# Altium schematic sheet STM32 microcontroller Power.SchDoc: STM32 microcontroller Power
size A4; CompanyName: STMicroelectronics; Organization: Microcontrollers Division; DocumentNumber: 5; SheetNumber: 4; SheetTotal: 19
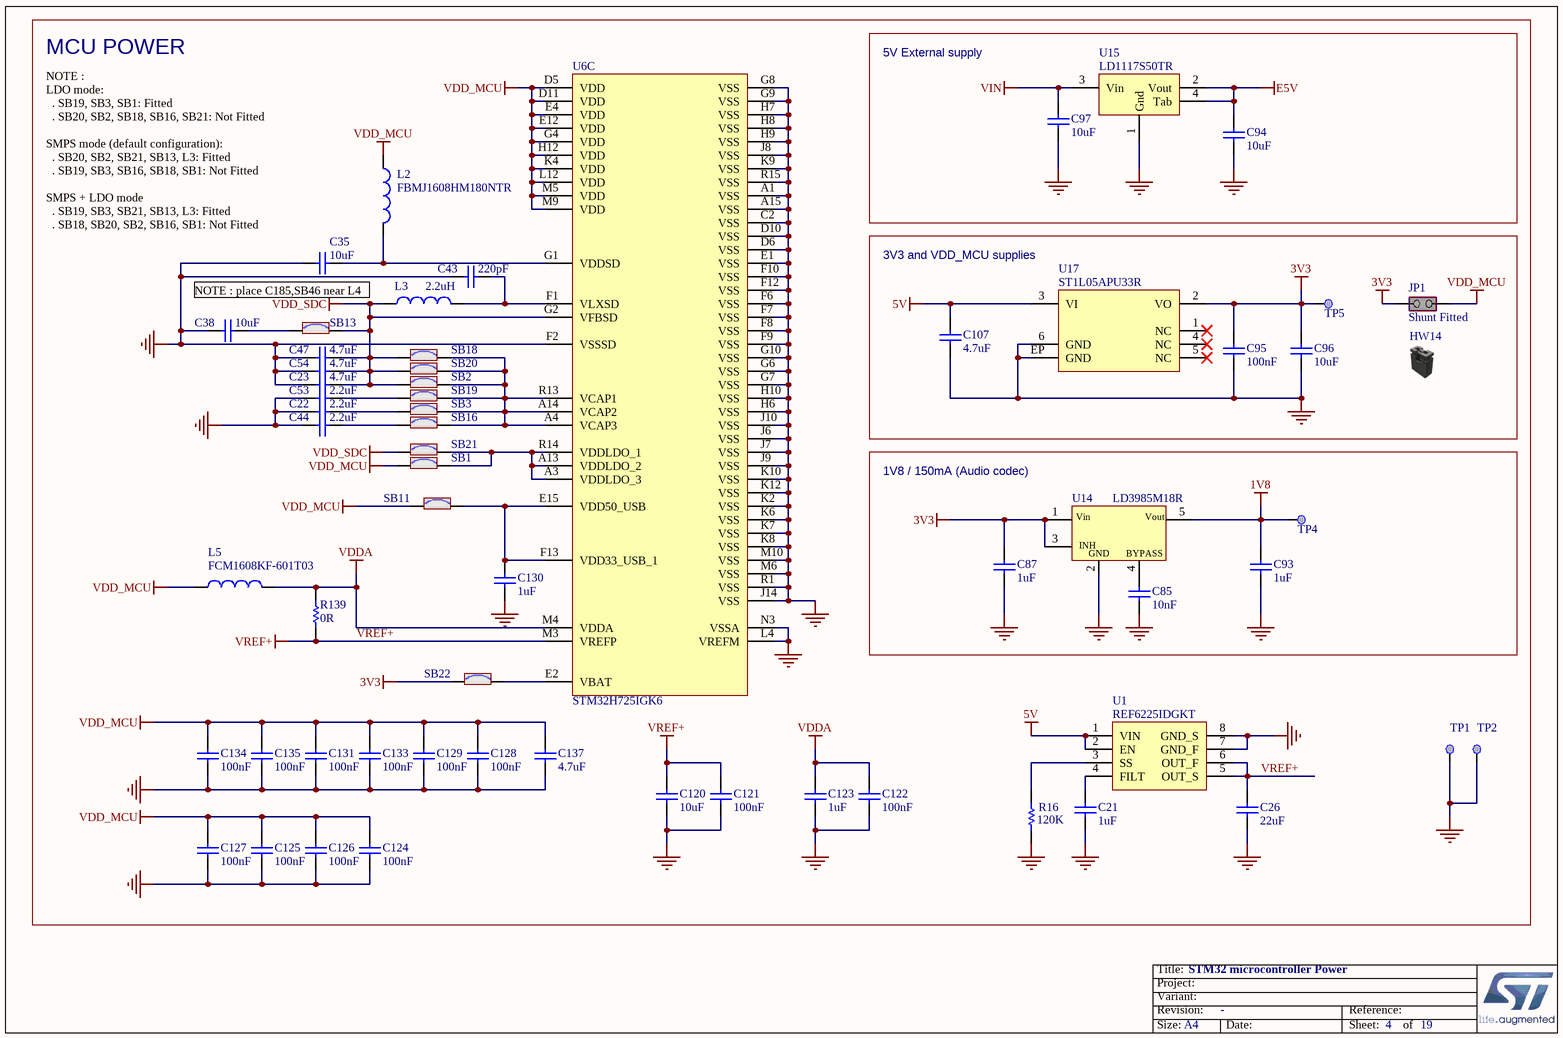
[diagram p0: STM32 microcontroller Power.SchDoc]

## Parts
C21  value 1uF  [C0603]  (hidden comment: Capacitor)
C22  value 2.2uF  [C0603]  (hidden comment: Capacitor)
C23  value 4.7uF  [C0402]  (hidden comment: Capacitor)
C26  value 22uF  [C1210]  (hidden comment: Capacitor)
C35  value 10uF  [C0402]  (hidden comment: Capacitor)
C38  value 10uF  [C0603]  (hidden comment: Capacitor)
C43  value 220pF  [C0402]  (hidden comment: Capacitor)
C44  value 2.2uF  [C0603]  (hidden comment: Capacitor)
C47  value 4.7uF  [C0402]  (hidden comment: Capacitor)
C53  value 2.2uF  [C0603]  (hidden comment: Capacitor)
C54  value 4.7uF  [C0402]  (hidden comment: Capacitor)
C85  value 10nF  [C0402]  (hidden comment: Capacitor)
C87  value 1uF  [C0402]  (hidden comment: Capacitor)
C93  value 1uF  [C0402]  (hidden comment: Capacitor)
C94  value 10uF  [C0805]  (hidden comment: Capacitor)
C95  value 100nF  [C0402]  (hidden comment: Capacitor)
C96  value 10uF  [C0805]  (hidden comment: Capacitor)
C97  value 10uF  [C0805]  (hidden comment: Capacitor)
C107  value 4.7uF  [C0603]  (hidden comment: Capacitor)
C120  value 10uF  [C0805]  (hidden comment: Capacitor)
C121  value 100nF  [C0402]  (hidden comment: Capacitor)
C122  value 100nF  [C0402]  (hidden comment: Capacitor)
C123  value 1uF  [C0402]  (hidden comment: Capacitor)
C124  value 100nF  [C0402]  (hidden comment: Capacitor)
C125  value 100nF  [C0402]  (hidden comment: Capacitor)
C126  value 100nF  [C0402]  (hidden comment: Capacitor)
C127  value 100nF  [C0402]  (hidden comment: Capacitor)
C128  value 100nF  [C0402]  (hidden comment: Capacitor)
C129  value 100nF  [C0402]  (hidden comment: Capacitor)
C130  value 1uF  [C0603]  (hidden comment: Capacitor)
C131  value 100nF  [C0402]  (hidden comment: Capacitor)
C133  value 100nF  [C0402]  (hidden comment: Capacitor)
C134  value 100nF  [C0402]  (hidden comment: Capacitor)
C135  value 100nF  [C0402]  (hidden comment: Capacitor)
C137  value 4.7uF  [C0402]  (hidden comment: Capacitor)
HW14  Shunt Black 2.54mm  (value not drawn)  (mechanical)
JP1  value Shunt Fitted  [CON_SAMTEC_TSW-102-07-G-S]  (hidden comment: Jumper_Header 2x1 Fitted)
L2  value FBMJ1608HM180NTR  [IND_TAIYO-YUDEN_FBMJ1608]  (hidden comment: Inductor)
L3  value 2.2uH  [IND_2016_MURATA_LQM2MPN2R2NG0]  (hidden comment: Inductor)
L5  Manufacturer_Part_Number: FCM1608KF-601T03  [L0603]  (hidden comment: BEAD)
R16  value 120K  [R0402]  (hidden comment: Resistor)
R139  value 0R  [R0603]  (hidden comment: Resistor)
SB1  SB_ON  [SOLDER-BRIDGE_R0603-0R]  (value not drawn)
SB2  SB_ON  [SOLDER-BRIDGE_R0603-0R]  (value not drawn)
SB3  SB_ON  [SOLDER-BRIDGE_R0603-0R]  (value not drawn)
SB11  SB_ON  [SOLDER-BRIDGE_R0603-0R]  (value not drawn)
SB13  SB_ON  [SOLDER-BRIDGE_R0603-0R]  (value not drawn)
SB16  SB_ON  [SOLDER-BRIDGE_R0603-0R]  (value not drawn)
SB18  SB_ON  [SOLDER-BRIDGE_R0603-0R]  (value not drawn)
SB19  SB_ON  [SOLDER-BRIDGE_R0603-0R]  (value not drawn)
SB20  SB_ON  [SOLDER-BRIDGE_R0603-0R]  (value not drawn)
SB21  SB_ON  [SOLDER-BRIDGE_R0603-0R]  (value not drawn)
SB22  SB_ON  [SOLDER-BRIDGE_R0603-0R]  (value not drawn)
TP1  Test Point  [TP_SMD_0-3MM]  (value not drawn)  (no BOM)
TP2  Test Point  [TP_SMD_0-3MM]  (value not drawn)  (no BOM)
TP4  Test Point  [TP_SMD_0-3MM]  (value not drawn)  (no BOM)
TP5  Test Point  [TP_SMD_0-3MM]  (value not drawn)  (no BOM)
U1  REF6225IDGKT  [ICC_VSSOP8_DGK_S-PDSO-G8_3X3_P065]
U6  value STM32H725IGK6  [ICC_UFBGA201_176+25_10X10_P065]  (hidden comment: STM32H725IGK6U)  (part C of 3)
U14  LD3985M18R  [REG_SOT23-5L]
U15  LD1117S50TR  [REG_SOT223-TAB]
U17  ST1L05APU33R  [ICC_DFN6-EPAD_3X3_P095]

## Blocks framed on the sheet
5V External supply: C94 C97 U15
3V3 and VDD_MCU supplies: C95 C96 C107 HW14 JP1 TP5 U17
1V8 / 150mA (Audio codec): C85 C87 C93 TP4 U14

## Nets
1V8: C93.2 TP4.1 U14.5(Vout)
3V3: C87.2 C95.1 C96.2 JP1.2(NO) SB22.1 TP5.1 U14.1(Vin) U14.3(CE) U17.2(VO)
5V: C107.2 U1.1(VIN) U1.2(EN) U17.3(VI)
E5V: C94.2 U15.2(Vout) U15.4(Tab)
GND: C21.1 C22.1 C23.2 C26.1 C35.1 C38.1 C43.1 C44.1 C47.2 C53.1 C54.2 C85.1 C87.1 C93.1 C94.1 C95.2 C96.1 C97.1 C107.1 C120.1 C121.1 C122.1 C123.2 C124.1 C125.1 C126.1 C127.1 C128.1 C129.1 C130.2 C131.1 C133.1 C134.1 C135.1 C137.1 R16.1 TP1.1 TP2.1 U1.7(GND_F) U1.8(GND_S) U6.A1(VSS) U6.A15(VSS) U6.C2(VSS) U6.D6(VSS) U6.D10(VSS) U6.E1(VSS) U6.F2(VSSSD) U6.F6(VSS) U6.F7(VSS) U6.F8(VSS) U6.F9(VSS) U6.F10(VSS) U6.F12(VSS) U6.G6(VSS) U6.G7(VSS) U6.G8(VSS) U6.G9(VSS) U6.G10(VSS) U6.H6(VSS) U6.H7(VSS) U6.H8(VSS) U6.H9(VSS) U6.H10(VSS) U6.J6(VSS) U6.J7(VSS) U6.J8(VSS) U6.J9(VSS) U6.J10(VSS) U6.J14(VSS) U6.K2(VSS) U6.K6(VSS) U6.K7(VSS) U6.K8(VSS) U6.K9(VSS) U6.K10(VSS) U6.K12(VSS) U6.L4(VREFM) U6.M6(VSS) U6.M10(VSS) U6.N3(VSSA) U6.R1(VSS) U6.R15(VSS) U14.2(GND) U15.1(Gnd) U17.6(GND) U17.EP(GND)
VDD_MCU: C124.2 C125.2 C126.2 C127.2 C128.2 C129.2 C131.2 C133.2 C134.2 C135.2 C137.2 JP1.1(COMMON) L2.1 L5.1 SB1.1 SB11.1 U6.D5(VDD) U6.D11(VDD) U6.E4(VDD) U6.E12(VDD) U6.G4(VDD) U6.H12(VDD) U6.K4(VDD) U6.L12(VDD) U6.M5(VDD) U6.M9(VDD)
VDD_SDC: C23.1 C47.1 C54.1 L3.1 SB2.1 SB13.2 SB18.1 SB20.1 SB21.1 U6.G2(VFBSD)
VDDA: C122.2 C123.1 L5.2 R139.2 U6.M4(VDDA)
VIN: C97.2 U15.3(Vin)
VREF+: C26.2 C120.2 C121.2 R139.1 U1.5(OUT_S) U1.6(OUT_F) U6.M3(VREFP)
NetC21_2: C21.2 U1.4(FILT)
NetC22_2: C22.2 SB3.1
NetC35_2: C35.2 L2.2 U6.G1(VDDSD)
NetC38_2: C38.2 SB13.1
NetC43_2: C43.2 L3.2 U6.F1(VLXSD)
NetC44_2: C44.2 SB16.1
NetC53_2: C53.2 SB19.1
NetC85_2: C85.2 U14.4(BYPASS)
NetC130_1: C130.1 SB11.2 U6.E15(VDD50_USB) U6.F13(VDD33_USB_1)
NetR16_2: R16.2 U1.3(SS)
NetSB1_2: SB1.2 SB21.2 U6.A3(VDDLDO_3) U6.A13(VDDLDO_2) U6.R14(VDDLDO_1)
NetSB2_2: SB2.2 SB3.2 SB16.2 SB18.2 SB19.2 SB20.2 U6.A4(VCAP3) U6.A14(VCAP2) U6.R13(VCAP1)
NetSB22_2: SB22.2 U6.E2(VBAT)

Not connected (* = marked no-connect by the designer): U17 1(NC)* 4(NC)* 5(NC)*

## Notes on the sheet
- MCU POWER
- (near C35) NOTE :
  LDO mode:
  . SB19, SB3, SB1: Fitted
  . SB20, SB2, SB18, SB16, SB21: Not Fitted
  SMPS mode (default configuration):
  . SB20, SB2, SB21, SB13, L3: Fitted
  . SB19, SB3, SB16, SB18, SB1: Not Fitted
  SMPS + LDO mode
  . SB19, SB3, SB21, SB13, L3: Fitted
  . SB18, SB20, SB2, SB16, SB1: Not Fitted
- NOTE : place C185,SB46 near L4
- Title:
- Project:
- Size:
- Revision:
- Variant:
- A4
- -
- Date:
- Reference:
- Sheet:
- of
- (in symbol MCD-00078) INH

## Library data of the parts
C21 C130 = MCD-00010: Capacitor, MLCC, 1uF, 16V, X5R, 10%, 0603, T=0,8mm; Manufacturer_Part_Number: CC0603KRX5R7BB105; Manufacturer: YAGEO; Provided_By: SUBCO; Internal_Part_Number: MCD-00010; Status: Released; Part_Type: Capacitor; Package: C0603; ComponentLink1Description: Datasheet; ComponentLink1URL: http://tunmcdsvn.tun.st.com/Component_Datasheet_Library/Trunk/Capacitors/Yageo_Multilayer_capacitor_X5R_series_100pF_to_100uF
C22 C44 C53 = MCD-00012: Capacitor, MLCC, 2.2uF, 10V, X5R, 10%, 0603, T=0,8mm; Manufacturer_Part_Number: CC0603KRX5R6BB225; Manufacturer: YAGEO; Alternate_Manufacturer_Part_Number: C0603C225K8PACTU; Alternate_Manufacturer: KEMET; Provided_By: SUBCO; Internal_Part_Number: MCD-00012; Status: Released; Part_Type: Capacitor; Package: C0603; ComponentLink1Description: Datasheet; ComponentLink1URL: http://tunmcdsvn.tun.st.com/Component_Datasheet_Library/Trunk/Capacitors/Yageo_Multilayer_capacitor_X5R_series_100pF_to_100uF
C23 C47 C54 = MCD-01356: Capacitor, MLCC, 4.7uF, 6V3, X5R, 20%, 0402, T=0,5mm; Manufacturer_Part_Number: GRM155R60J475ME47; Manufacturer: MURATA; Provided_By: SUBCO; Internal_Part_Number: MCD-01356; ComponentLink1Description: Datasheet; Status: Released; Part_Type: Capacitor; Package: C0402; ComponentLink1URL: http://tunmcdsvn.tun.st.com/Component_Datasheet_Library/Trunk/Capacitors/Murata_Capacitor_GR_series
C26 = MCD-00614: Capacitor, MLCC, 22uF, 16V, 1210, X7R, 20%, T=2,5mm, ESR 2mohm@410KHz; Manufacturer_Part_Number: GCM32ER71C226ME19; Manufacturer: MURATA; Provided_By: SUBCO; Internal_Part_Number: MCD-00614; Status: Checked; Part_Type: Capacitor; Package: C1210; ComponentLink1Description: Datasheet; ComponentLink1URL: http://tunmcdsvn.tun.st.com/Component_Datasheet_Library/Trunk/Capacitors/Murata_Capacitor_GC_series
C35 = MCD-01355: Capacitor, MLCC, 10uF, 4V, X5R, 20%, 0402, T=0,5mm; Manufacturer_Part_Number: GRM155R60G106ME44; Manufacturer: MURATA; Provided_By: SUBCO; Internal_Part_Number: MCD-01355; ComponentLink1Description: Datasheet; Status: Released; Part_Type: Capacitor; Package: C0402; ComponentLink1URL: http://tunmcdsvn.tun.st.com/Component_Datasheet_Library/Trunk/Capacitors/Murata_Capacitor_GR_series
C38 = MCD-01341: Capacitor, MLCC, 10uF, 6V3, X5R, 20%, 0603, T=0,8mm; Manufacturer_Part_Number: GRM188R60J106ME47D; Manufacturer: MURATA; Provided_By: SUBCO; Internal_Part_Number: MCD-01341; ComponentLink1Description: Datasheet; Status: Released; Part_Type: Capacitor; Package: C0603; ComponentLink1URL: http://tunmcdsvn.tun.st.com/Component_Datasheet_Library/Trunk/Capacitors/Murata_Capacitor_GR_series
C43 = MCD-01225: Capacitor, MLCC, 220pF, 50V, NPO, 5%, 0402, T=0,5mm; Manufacturer_Part_Number: CC0402JRNPO9BN221; Manufacturer: YAGEO; Provided_By: SUBCO; Internal_Part_Number: MCD-01225; Status: Released; Part_Type: Capacitor; Package: C0402; ComponentLink1Description: Datasheet; ComponentLink1URL: http://tunmcdsvn.tun.st.com/Component_Datasheet_Library/Trunk/Capacitors/Yageo_Capacitor_NP0_16V-to-50V
C85 = MCD-00011: Capacitor, MLCC, 10nF, 16V, X7R, 10%, 0402, T=0.5mm; Manufacturer_Part_Number: CC0402KRX7R7BB103; Manufacturer: YAGEO; ECCN_US: EAR99; ECCN_EU: NEC; Provided_By: SUBCO; Internal_Part_Number: MCD-00011; Status: Released; Part_Type: Capacitor; Package: C0402; ComponentLink1Description: Datasheet; ComponentLink1URL: http://tunmcdsvn.tun.st.com/Component_Datasheet_Library/Trunk/Capacitors/Yageo_Multilayer_Capacitor_X7R_series_100pF_to_22uF
C87 C93 = MCD-00095: Capacitor, MLCC, 1uF, 6V3, X5R, 10%, 0402, T=0,5mm; Manufacturer_Part_Number: GRM155R61E105KA12; Manufacturer: MURATA; Alternate_Manufacturer_Part_Number: GRM155R60J105KE19; ECCN_US: EAR99; ECCN_EU: NEC; Provided_By: SUBCO; Internal_Part_Number: MCD-00095; Status: Released; Part_Type: Capacitor; Alternate_Manufacturer: MURATA; Package: C0402; ComponentLink1Description: Datasheet; ComponentLink1URL: http://tunmcdsvn.tun.st.com/Component_Datasheet_Library/Trunk/Capacitors/Murata_Capacitor_GR_series
C94 C96 C97 C120 = MCD-00014: Capacitor, MLCC, 10uF, 25V, X5R, 10%, 0805, T=0,85mm; Manufacturer_Part_Number: CC0805KRX5R8BB106; Manufacturer: YAGEO; Provided_By: SUBCO; Internal_Part_Number: MCD-00014; ComponentLink1Description: Datasheet; Status: Released; Part_Type: Capacitor; Package: C0805; ComponentLink1URL: http://tunmcdsvn.tun.st.com/Component_Datasheet_Library/Trunk/Capacitors/Yageo_Multilayer_capacitor_X5R_series_100pF_to_100uF
C95 C121 C122 C124-C129 C131 C133-C135 = MCD-00102: Capacitor, MLCC, 100nF, 16V, X7R, 10%, 0402, T=0,5mm; Manufacturer_Part_Number: CC0402KRX7R7BB104; Manufacturer: YAGEO; Alternate_Manufacturer_Part_Number: GCM155R71C104KA55D; Alternate_Manufacturer: MURATA; Provided_By: SUBCO; Internal_Part_Number: MCD-00102; Status: Released; Part_Type: Capacitor; Package: C0402; ComponentLink1Description: Datasheet; ComponentLink1URL: http://tunmcdsvn.tun.st.com/Component_Datasheet_Library/Trunk/Capacitors/Yageo_Multilayer_Capacitor_X7R_series_100pF_to_22uF
C107 = MCD-00097: Capacitor, MLCC, 4.7uF, 16V, X5R, 20%, 0603, T=0,8mm; Manufacturer_Part_Number: GRM188R61C475KE11; Manufacturer: MURATA; Alternate_Manufacturer_Part_Number: GRM188R61C475MAAJ; ECCN_US: EAR99; ECCN_EU: NEC; Provided_By: SUBCO; Internal_Part_Number: MCD-00097; Status: Released; Part_Type: Capacitor; Alternate_Manufacturer: Murata; Package: C0603; ComponentLink1Description: Datasheet; ComponentLink1URL: http://tunmcdsvn.tun.st.com/Component_Datasheet_Library/Trunk/Capacitors/Murata_Capacitor_GR_series
C123 = MCD-01722: Capacitor, 1uF, 10V, X5R, 10%, 0402, T=0.5mm; Manufacturer_Part_Number: CC0402KRX5R6BB105; Manufacturer: YAGEO; Provided_By: SUBCO; Internal_Part_Number: MCD-01722; Status: Released; Part_Type: Capacitor; Package: C0402; ComponentLink1Description: Datasheet; ComponentLink1URL: http://tunmcdsvn.tun.st.com/Component_Datasheet_Library/Trunk/Capacitors/Yageo_Multilayer_capacitor_X5R_series_100pF_to_100uF/Yageo_Multilayer_capacitor_X5R_100pF_to_100uF.pdf; ECCN_US: N/A; ECCN_EU: N/A
C137 = MCD-01356: Capacitor, MLCC, 4.7uF, 6V3, X5R, 20%, 0402, T=0,5mm; Manufacturer_Part_Number: GRM155R60J475ME47; Manufacturer: MURATA; ECCN_US: EAR99; ECCN_EU: NEC; Provided_By: SUBCO; Internal_Part_Number: MCD-01356; Status: Released; Part_Type: Capacitor; Package: C0402; ComponentLink1Description: Datasheet; ComponentLink1URL: http://tunmcdsvn.tun.st.com/Component_Datasheet_Library/Trunk/Capacitors/Murata_Capacitor_GR_series
HW14 = MCD-00043: SHUNT 2.54mm BLACK; Manufacturer_Part_Number: SNT-100-BK-G; Manufacturer: SAMTEC; Part_Type: Mechanical; Alternate_Manufacturer_Part_Number: 316102S111A; Alternate_Manufacturer: JIUBABA; Provided_By: SUBCO; Value: SNT-100-BK-G; Internal_Part_Number: MCD-00043; ComponentLink1Description: Datasheet; Status: Released; ComponentLink1URL: http://tunmcdsvn.tun.st.com/Component_Datasheet_Library/Trunk/Connectors/Samtec_Shunt_Jumper_SNT100
JP1 = MCD-00683: Header, 2x1, 2,54mm, VR, TH, Height 5.84mm/2.54mm - Shunt Fitted by default; Part_Type: Connector; Manufacturer_Part_Number: TSW-102-07-x-S; Manufacturer: SAMTEC; Provided_By: SUBCO; Internal_Part_Number: MCD-00683; Status: Released; ComponentLink1Description: Datasheet; ComponentLink1URL: http://tunmcdsvn.tun.st.com/Component_Datasheet_Library/Trunk/Connectors/Samtec_TSW-HTSW-series
L2 = MCD-01431: Ferrite Bead 18 ohm@100MHz 0603; Manufacturer: TAIYO YUDEN; Provided_By: SUBCO; Internal_Part_Number: MCD-01431; Status: Checked; Part_Type: Inductor; Manufacturer_Part_Number: FBMJ1608HM180NTR; Package: L0603; ComponentLink1Description: Datasheet; ComponentLink1URL: http://tunmcdsvn.tun.st.com/Component_Datasheet_Library/Trunk/Inductors/TaiyoYuden_Bead_FBA,%20FBR%20Series/TaiyoYuden_Bead_FBA,%20FBR%20Series.pdf
L3 = MCD-01110: Inductor 2.2uH, 2x1.6x0.9mm; Manufacturer_Part_Number: LQM2MPN2R2NG0; Manufacturer: MURATA; Provided_By: SUBCO; Internal_Part_Number: MCD-01110; Status: Footprint available; Part_Type: Inductor; ComponentLink1Description: Datasheet; ComponentLink1URL: http://tunmcdsvn.tun.st.com/Component_Datasheet_Library/Trunk/Inductors/Murata_inductor_LQM2MPN/Murata_inductor_LQM2MPN.pdf; ECCN_US: n/a; ECCN_EU: n/a
L5 = MCD-00047: SMD Chip ferrite bead, 600R@100MHz +/-25%, 350mA, 500mohm DC, 0603, T=0.8mm; Part_Type: Inductor; Manufacturer: TAI-TECH; Provided_By: SUBCO; Internal_Part_Number: MCD-00047; Value: 600R@100MHz; Status: Released; ComponentLink1Description: Datasheet; ComponentLink1URL: http://tunmcdsvn.tun.st.com/Component_Datasheet_Library/Trunk/Inductors/TaiTech_Bead_FCM1608_series
R16 = MCD-00166: Resistor,120K,0402,1%,1/16W; Manufacturer_Part_Number: RC0402FR-07120KL; Manufacturer: YAGEO; Provided_By: SUBCO; Internal_Part_Number: MCD-00166; Status: Footprint available; Part_Type: Resistor; Package: R0402; ComponentLink1Description: Datasheet; ComponentLink1URL: http://tunmcdsvn.tun.st.com/Component_Datasheet_Library/Trunk/Resistors/Yageo_Resistor_RC0402-series
R139 = MCD-00056: Resistor,0R,0603,5%,1/10W; Manufacturer_Part_Number: RC0603JR-070RL; Manufacturer: YAGEO; ECCN_US: EAR99; ECCN_EU: NEC; Provided_By: SUBCO; Internal_Part_Number: MCD-00056; Status: Released; Part_Type: Resistor; Package: R0603; ComponentLink1Description: Datasheet; ComponentLink1URL: http://tunmcdsvn.tun.st.com/Component_Datasheet_Library/Trunk/Resistors/Yageo_Resistor_RC0603-series
SB1-SB3 SB11 SB13 SB16 SB18-SB22 = MCD-00071: Solder Bridge ON; Part_Type: Mechanical; Manufacturer_Part_Number: RC0603JR-070RL; Manufacturer: YAGEO; Provided_By: SUBCO; Internal_Part_Number: MCD-00071; Status: Released; Package: SB0603; ComponentLink1Description: Datasheet; ComponentLink1URL: http://tunmcdsvn.tun.st.com/Component_Datasheet_Library/Trunk/Resistors/Yageo_Resistor_RC0603-series
TP1 TP2 TP4 TP5 = MCD-00630: Test Point 0.3mm; Part_Type: Mechanical; Internal_Part_Number: MCD-00630; Status: Released; Provided_By: n/a; ComponentLink1Description: Datasheet
U1 = MCD-01138: IC VREF SERIES 2.5V 8VSSOP; Manufacturer: TI; Provided_By: SUBCO; Internal_Part_Number: MCD-01138; Value: REF6225IDGKT; Status: Footprint available; Part_Type: IC; Manufacturer_Part_Number: REF6225IDGKT; Package: VSSOP8; ComponentLink1Description: Datasheet; ComponentLink1URL: http://tunmcdsvn.tun.st.com/Component_Datasheet_Library/Trunk/IC/TI_REF_REF6225IDGKT/TI_REF_REF6225IDGKT.pdf
U6 = MCD-01673: STM32H725IGK6 MCU, Cut1.0, 10x10x0.6mm, Pitch0.65mm, Int SMPS; Part_Type: IC; Manufacturer: STMICROELECTRONICS; ECCN_US: 3A991A2; ECCN_EU: NEC; Provided_By: SUBCO with ST control; Internal_Part_Number: MCD-01673; Status: Checked; Manufacturer_Part_Number: STM32H725IGK6; Package: UFBGA176+25; ComponentLink1Description: Datasheet; ComponentLink1URL: http://tunmcdsvn.tun.st.com/Component_Datasheet_Library/Trunk/IC/STM_MCU_STM32H725IGK6U_UFBGA176
U14 = MCD-00078: Ultra low drop-low noise BiCMOS voltage, regulators low ESR capacitors compatible; Part_Type: IC; Manufacturer: STMICROELECTRONICS; BMS_Part_Number: 9176159; ECCN_US: EAR99; ECCN_EU: NEC; Provided_By: SUBCO with ST control; Internal_Part_Number: MCD-00078; Value: LD3985M18R; Status: Released; Manufacturer_Part_Number: LD3985M18R; ComponentLink1Description: Datasheet; ComponentLink1URL: http://tunmcdsvn.tun.st.com/Component_Datasheet_Library/Trunk/IC/STM_LDO_LD3985
U15 = MCD-00088: IC REG LDO 5V 0.8A SOT223; Manufacturer: STMICROELECTRONICS; BMS_Part_Number: 9176133; Provided_By: SUBCO with ST control; Internal_Part_Number: MCD-00088; Value: LD1117S50TR; Status: Released; Part_Type: IC; Manufacturer_Part_Number: LD1117S50TR; ComponentLink1Description: Datasheet; ComponentLink1URL: http://tunmcdsvn.tun.st.com/Component_Datasheet_Library/Trunk/IC/STM_LDO_LD1117; Package: SOT-223
U17 = MCD-01127: IC REG LDO 3.3V 1.3A 6DFN; Manufacturer: STMICROELECTRONICS; BMS_Part_Number: 9176247; Provided_By: SUBCO with ST control; Internal_Part_Number: MCD-01127; Value: ST1L05APU33R; Status: Footprint available; Part_Type: IC; Manufacturer_Part_Number: ST1L05APU33R; Package: DFN6; ComponentLink1Description: Datasheet; ComponentLink1URL: http://tunmcdsvn.tun.st.com/Component_Datasheet_Library/Trunk/IC/STM_LDO_ST1L05CPU33R/STM_LDO_ST1L05CPU33R.pdf